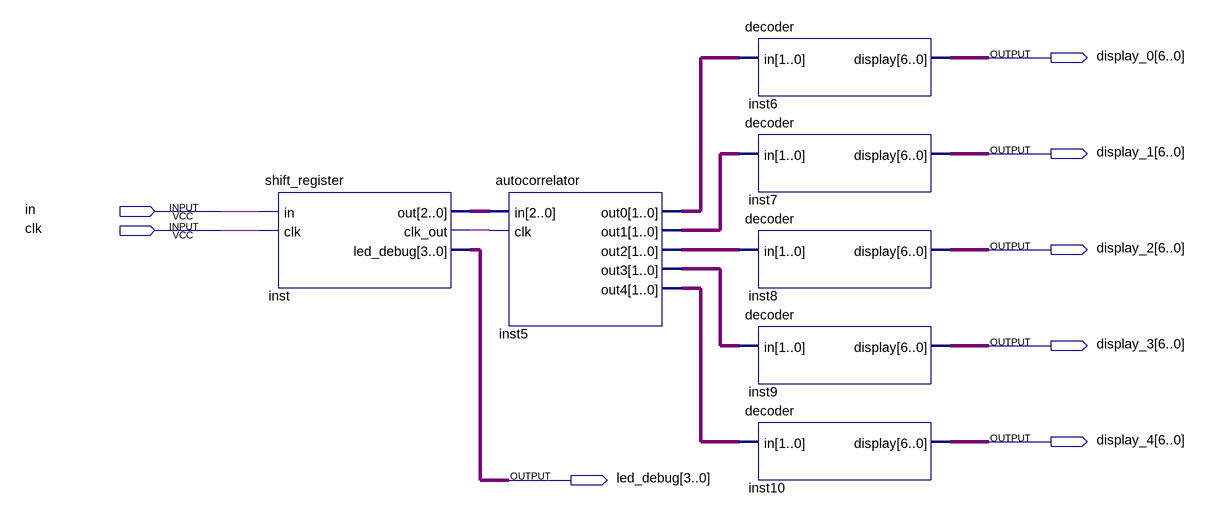
[diagram p0: schematic sheet]
// Quartus schematic Autocorrelation.bdf as structural Verilog: 7 symbols, 8 pins
module Autocorrelation (
  input  in,
  input  clk,
  output [6:0] display_0,
  output [6:0] display_1,
  output [6:0] display_2,
  output [6:0] display_3,
  output [6:0] display_4,
  output [3:0] led_debug
);

  wire inst_clk_out;
  wire [1:0] inst5_out0, inst5_out1, inst5_out2, inst5_out3, inst5_out4;
  wire [2:0] inst_out;

  shift_register inst (.in(in), .clk(clk), .out(inst_out), .clk_out(inst_clk_out), .led_debug(led_debug));
  autocorrelator inst5 (
    .in(inst_out), .clk(inst_clk_out), .out0(inst5_out0), .out1(inst5_out1), .out2(inst5_out2),
    .out3(inst5_out3), .out4(inst5_out4));
  decoder inst6 (.in(inst5_out0), .display(display_0));
  decoder inst7 (.in(inst5_out1), .display(display_1));
  decoder inst8 (.in(inst5_out2), .display(display_2));
  decoder inst9 (.in(inst5_out3), .display(display_3));
  decoder inst10 (.in(inst5_out4), .display(display_4));
endmodule
